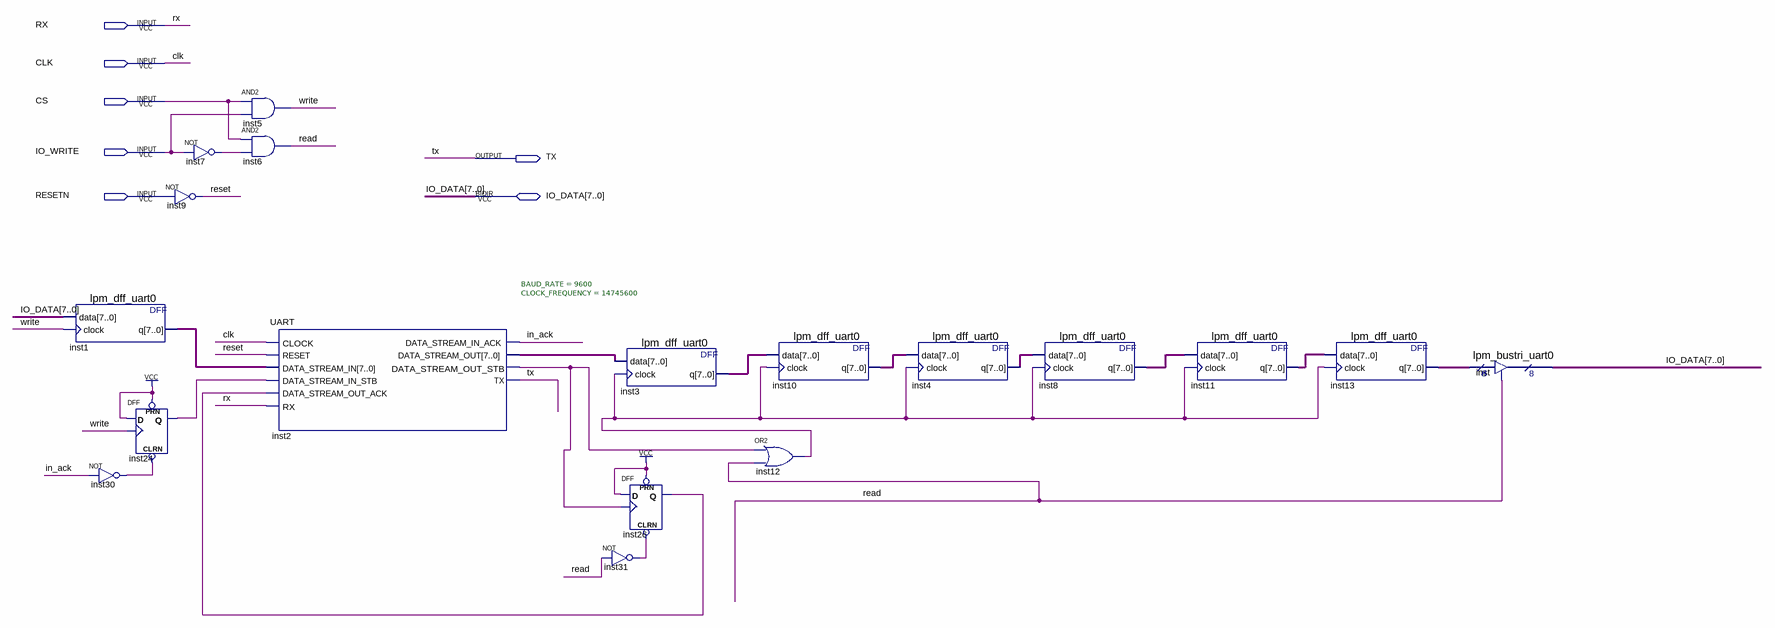
[diagram p0: schematic sheet]
// Quartus schematic UART_INTERFACE.bdf as structural Verilog: 18 symbols, 7 pins
module UART_INTERFACE (
  input  RX,
  input  CLK,
  input  CS,
  input  IO_WRITE,
  input  RESETN,
  inout  [7:0] IO_DATA,
  output TX
);

  wire in_ack, inst2_data_stream_out_stb, inst7_out, inst12_out, inst24_q, inst26_q, inst30_out, inst31_out,
       read, reset, write;
  wire [7:0] inst1_q, inst2_data_stream_out, inst3_q, inst4_q, inst8_q, inst10_q, inst11_q, inst13_q;

  lpm_dff_uart0 inst1 (.data(IO_DATA), .clock(write), .q(inst1_q));
  not inst30 (inst30_out, in_ack);
  DFF inst24 (.CLRN(inst30_out), .CLK(write), .D(1'b1), .PRN(1'b1), .Q(inst24_q));
  not inst7 (inst7_out, IO_WRITE);
  not inst9 (reset, RESETN);
  and inst5 (write, CS, IO_WRITE);
  and inst6 (read, CS, inst7_out);
  UART #(.BAUD_RATE(9600), .CLOCK_FREQUENCY(14745600)) inst2 (
    .CLOCK(CLK), .RESET(reset), .DATA_STREAM_IN(inst1_q), .DATA_STREAM_IN_STB(inst24_q),
    .DATA_STREAM_OUT_ACK(inst26_q), .RX(RX), .DATA_STREAM_IN_ACK(in_ack),
    .DATA_STREAM_OUT(inst2_data_stream_out), .DATA_STREAM_OUT_STB(inst2_data_stream_out_stb), .TX(TX));
  not inst31 (inst31_out, read);
  lpm_dff_uart0 inst3 (.data(inst2_data_stream_out), .clock(inst12_out), .q(inst3_q));
  DFF inst26 (.CLRN(inst31_out), .CLK(inst2_data_stream_out_stb), .D(1'b1), .PRN(1'b1), .Q(inst26_q));
  or inst12 (inst12_out, inst2_data_stream_out_stb, read);
  lpm_dff_uart0 inst10 (.data(inst3_q), .clock(inst12_out), .q(inst10_q));
  lpm_dff_uart0 inst4 (.data(inst10_q), .clock(inst12_out), .q(inst4_q));
  lpm_dff_uart0 inst8 (.data(inst4_q), .clock(inst12_out), .q(inst8_q));
  lpm_dff_uart0 inst11 (.data(inst8_q), .clock(inst12_out), .q(inst11_q));
  lpm_dff_uart0 inst13 (.data(inst11_q), .clock(inst12_out), .q(inst13_q));
  lpm_bustri_uart0 inst (.enabledt(read), .data(inst13_q), .tridata(IO_DATA));
endmodule
